# Altium schematic sheet 05 MISC.SchDoc
size 420 x 297 mm
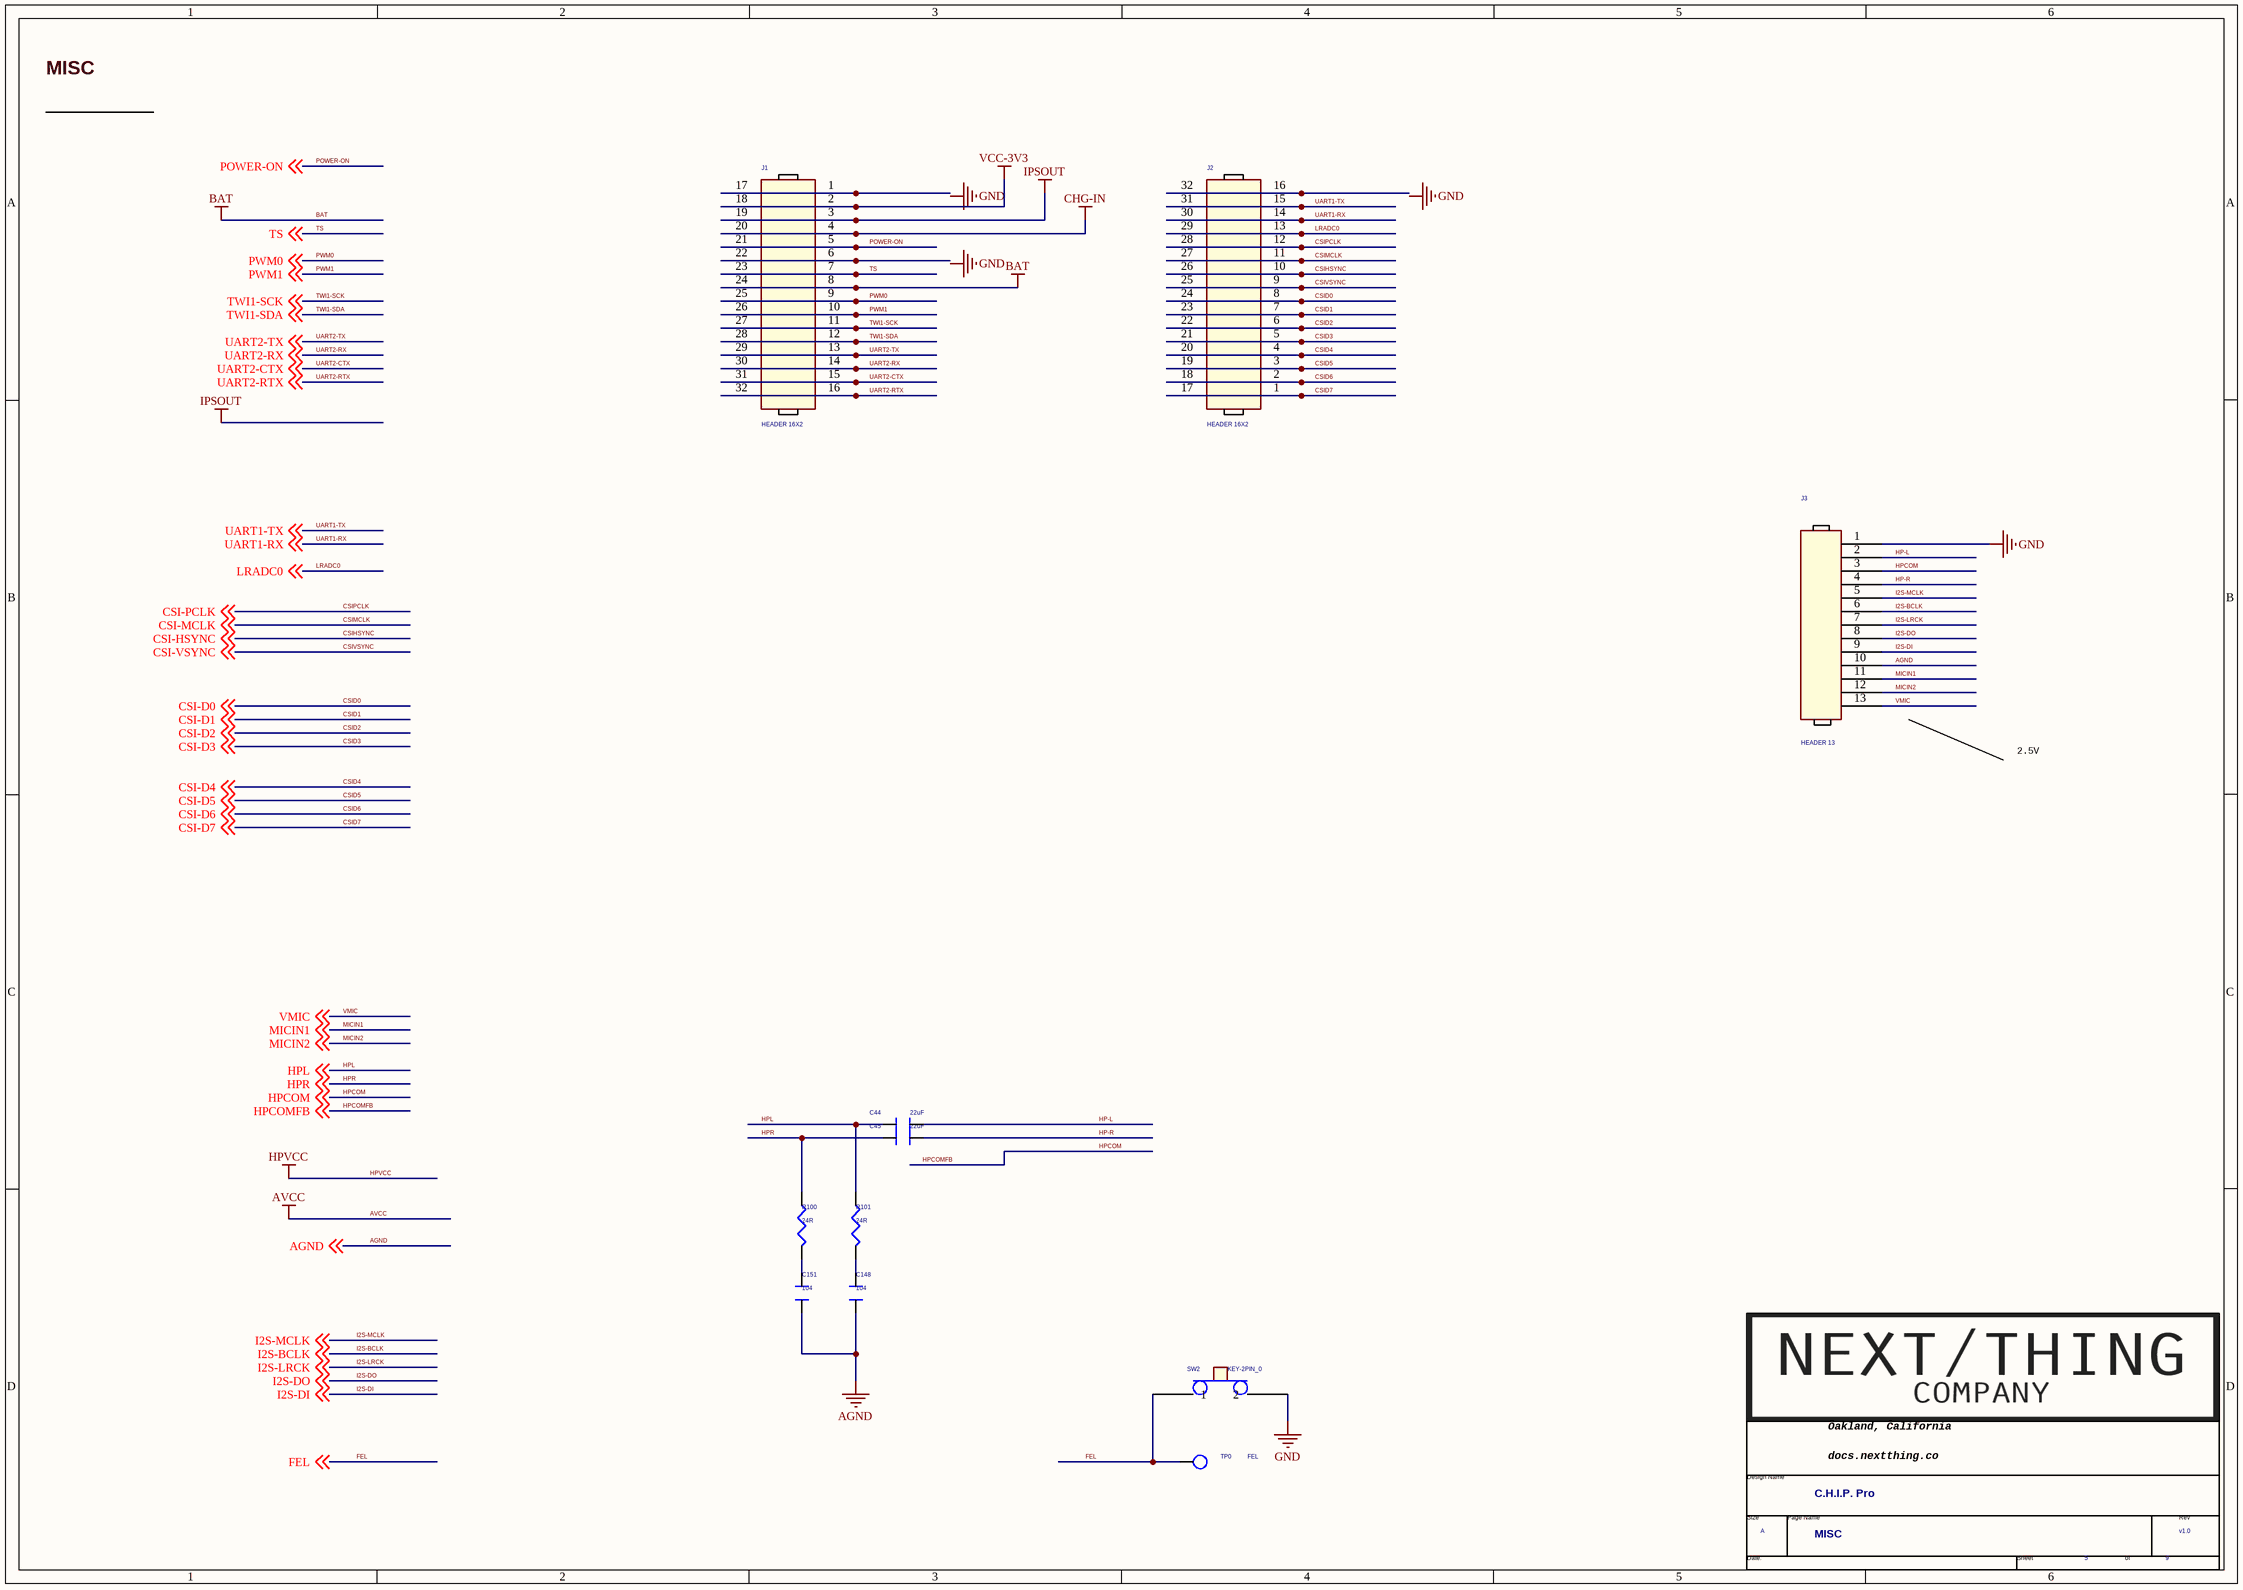
[diagram p0: 05 MISC.SchDoc]

## Parts
*  Page Count: 9  Page Number: 5  Page Size: A  Title: C.H.I.P. Pro  RevCode: v1.0  Doc: MISC  (hidden comment: TitleBlock1-nextthing)  (graphical)
C44  22uF  [C0805]
C45  22uF  [C0805]
C148  104  [C0201]
C151  104  [C0201]
J1  HEADER 16X2  [stampvia16]
J2  HEADER 16X2  [stampvia16]
J3  HEADER 13  [stampvia13]
R100  24R  [R0402]
R101  24R  [R0402]
SW2  KEY-2PIN_0  [KEY-2]
TP0  FEL  [tp40_smd]

## Nets
AGND: C148.2 C151.2 J3.10 ; off-sheet AGND
BAT: J1.8 J1.24
CHG-IN: J1.4 J1.20
GND: J3.1 SW2.2
IPSOUT: J1.3 J1.19
VCC-3V3: J1.2 J1.18
CSID0: J2.8 J2.24 ; off-sheet CSI-D0  [also labelled CSI-D0]
CSID1: J2.7 J2.23 ; off-sheet CSI-D1  [also labelled CSI-D1]
CSID2: J2.6 J2.22 ; off-sheet CSI-D2  [also labelled CSI-D2]
CSID3: J2.5 J2.21 ; off-sheet CSI-D3  [also labelled CSI-D3]
CSID4: J2.4 J2.20 ; off-sheet CSI-D4  [also labelled CSI-D4]
CSID5: J2.3 J2.19 ; off-sheet CSI-D5  [also labelled CSI-D5]
CSID6: J2.2 J2.18 ; off-sheet CSI-D6  [also labelled CSI-D6]
CSID7: J2.1 J2.17 ; off-sheet CSI-D7  [also labelled CSI-D7]
CSIHSYNC: J2.10 J2.26 ; off-sheet CSI-HSYNC  [also labelled CSI-HSYNC]
CSIMCLK: J2.11 J2.27 ; off-sheet CSI-MCLK  [also labelled CSI-MCLK]
CSIPCLK: J2.12 J2.28 ; off-sheet CSI-PCLK  [also labelled CSI-PCLK]
CSIVSYNC: J2.9 J2.25 ; off-sheet CSI-VSYNC  [also labelled CSI-VSYNC]
FEL: SW2.1 TP0.1(TP) ; off-sheet FEL
HP-L: C44.2 J3.2
HP-R: C45.2 J3.4
HPCOM: J3.3 ; off-sheet HPCOM, off-sheet HPCOMFB  [also labelled HPCOMFB]
HPL: C44.1 R101.1 ; off-sheet HPL
HPR: C45.1 R100.1 ; off-sheet HPR
I2S-BCLK: J3.6 ; off-sheet I2S-BCLK
I2S-DI: J3.9 ; off-sheet I2S-DI
I2S-DO: J3.8 ; off-sheet I2S-DO
I2S-LRCK: J3.7 ; off-sheet I2S-LRCK
I2S-MCLK: J3.5 ; off-sheet I2S-MCLK
LRADC0: J2.13 J2.29 ; off-sheet LRADC0
MICIN1: J3.11 ; off-sheet MICIN1
MICIN2: J3.12 ; off-sheet MICIN2
POWER-ON: J1.5 J1.21 ; off-sheet POWER-ON
PWM0: J1.9 J1.25 ; off-sheet PWM0
PWM1: J1.10 J1.26 ; off-sheet PWM1
TS: J1.7 J1.23 ; off-sheet TS
TWI1-SCK: J1.11 J1.27 ; off-sheet TWI1-SCK
TWI1-SDA: J1.12 J1.28 ; off-sheet TWI1-SDA
UART1-RX: J2.14 J2.30 ; off-sheet UART1-RX
UART1-TX: J2.15 J2.31 ; off-sheet UART1-TX
UART2-CTX: J1.15 J1.31 ; off-sheet UART2-CTX
UART2-RTX: J1.16 J1.32 ; off-sheet UART2-RTX
UART2-RX: J1.14 J1.30 ; off-sheet UART2-RX
UART2-TX: J1.13 J1.29 ; off-sheet UART2-TX
VMIC: J3.13 ; off-sheet VMIC
NetC148_1: C148.1 R101.2
NetC151_1: C151.1 R100.2
NetJ1_1: J1.1 J1.17
NetJ1_6: J1.6 J1.22
NetJ2_16: J2.16 J2.32

## Notes on the sheet
- MISC
- 2.5V
- Labels drawn without touching a wire or pin: GND
- (in symbol TitleBlock1-nextthing) Oakland, California; Design Name; docs.nextthing.co /; Size; Page Name; Rev; Date:; Sheet; of

## Library data of the parts
C44 C45 = CAPACITOR_0: PAGE: 1
C148 C151 = CAPACITOR_0_Dup1: PAGE: 1
J1 J2 = HEADER 16X2_0
R100 R101 = ?_0
TP0 = T_POINT_R
* = TitleBlock1-nextthing: Page Create Date: March  8, 1995